# EAGLE design openebi (EAGLE 5.12)
FARNELL: 1135236

## Sheet 1 of 2
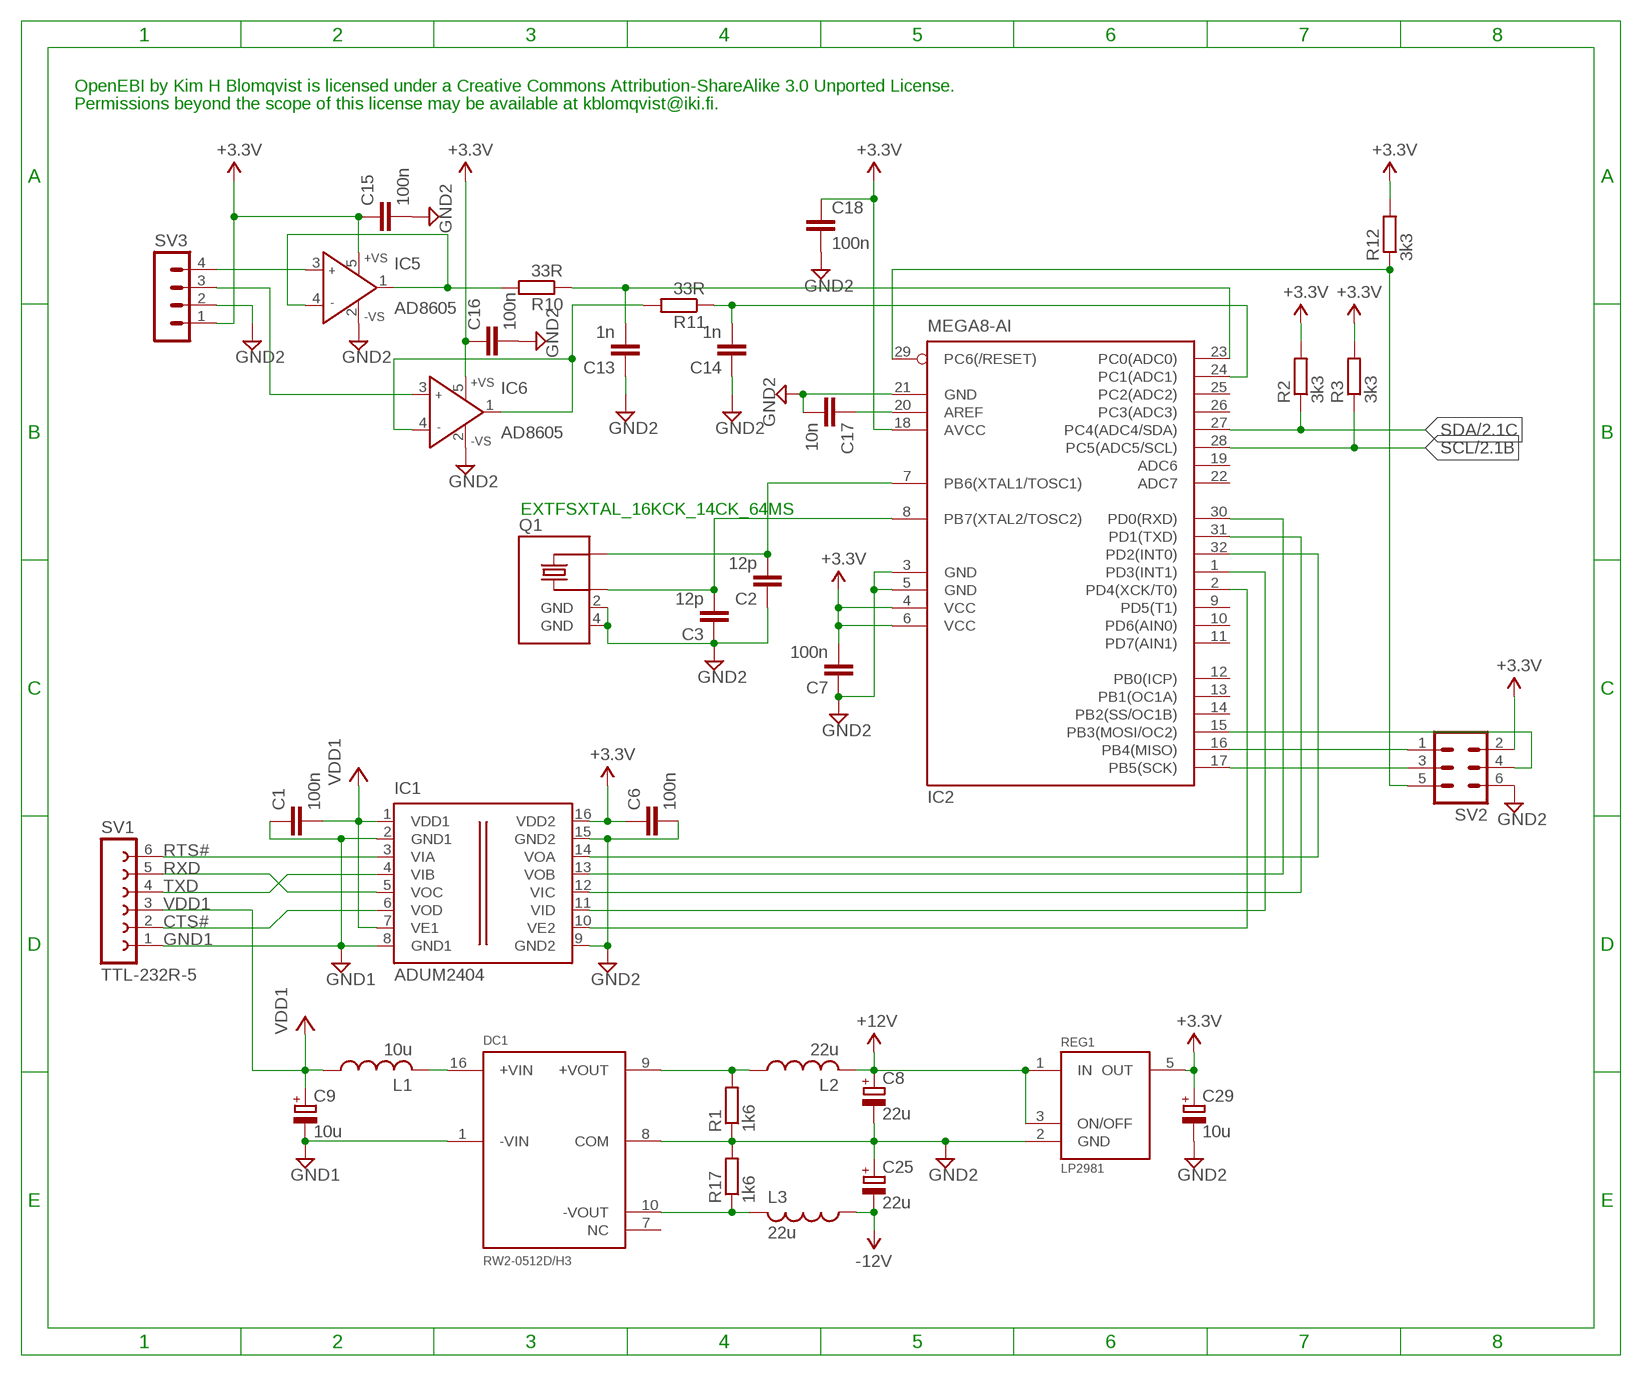
[diagram p0: schematic, sheet 1]

### Parts
C1  100n  C-EUC0402  [C0402]
C2  12p  C-EUC0402  [C0402]
C3  12p  C-EUC0402  [C0402]
C6  100n  C-EUC0402  [C0402]
C7  100n  C-EUC0402  [C0402]
C8  22u  CPOL-EUB/3528-21R  [B/3528-21R]
C9  10u  CPOL-EUA/3216-18R  [A/3216-18R]
C13  1n  C-EUC0402  [C0402]
C14  1n  C-EUC0402  [C0402]
C15  100n  C-EUC0402  [C0402]
C16  100n  C-EUC0402  [C0402]
C17  10n  C-EUC0402  [C0402]
C18  100n  C-EUC0402  [C0402]
C25  22u  CPOL-EUB/3528-21R  [B/3528-21R]
C29  10u  CPOL-EUA/3216-18R  [A/3216-18R]
DC1  RW2-0512D/H3  RECOM-RW2  [RECOM-MINI-DIP16]
IC1  ADUM2404  [SO-16W]
IC2  MEGA8-AI  [TQFP32-08]
IC5  AD8605  AD8541RJ  [SOT23-5]
IC6  AD8605  AD8541RJ  [SOT23-5]
L1  10u  L2828  [L2828]
L2  22u  L2828  [L2828]
L3  22u  L2828  [L2828]
Q1  CRYSTAL-3.2X2.5  [CRYSTAL-3.2X2.5]
R1  1k6  R-EU_R1206  [R1206]
R2  3k3  R-EU_R0402  [R0402]
R3  3k3  R-EU_R0402  [R0402]
R10  33R  R-EU_R0402  [R0402]
R11  33R  R-EU_R0402  [R0402]
R12  3k3  R-EU_R0402  [R0402]
R17  1k6  R-EU_R1206  [R1206]
REG1  LP2981  [SOT23-5]
SV1  TTL-232R-5  TTL-232R  [FE06W]
SV2  MA03-2  [MA03-2]
SV3  MA04-1  [MA04-1]

### Nets
+3.3V: C6.1 C7.2 C15.1 C16.1 C18.1 C29.+ IC1.16(VDD2) IC2.4(VCC) IC2.6(VCC) IC2.18(AVCC) IC5.5(+VS) IC6.5(+VS) R2.2 R3.2 R12.2 REG1.5(OUT) SV2.2 SV3.1
+12V: C8.+ L2.2 REG1.1(IN) REG1.3(ON/OFF) ; also sheet 2
-12V: C25.- L3.1 ; also sheet 2
CTS#: IC1.6(VOD) SV1.2(CTS#)
GND1: C1.1 C9.- DC1.1(-VIN) IC1.2(GND1) IC1.8(GND1) SV1.1(GND)
GND2: C2.1 C3.1 C6.2 C7.1 C8.- C13.1 C14.1 C15.2 C16.2 C17.2 C18.2 C25.+ C29.- DC1.8(COM) IC1.9(GND2) IC1.15(GND2) IC2.3(GND) IC2.5(GND) IC2.21(GND) IC5.2(-VS) IC6.2(-VS) Q1.2(GND) Q1.4(GND) R1.1 R17.2 REG1.2(GND) SV2.6 SV3.2 ; also sheet 2
N$1: C3.2 IC2.8(PB7(XTAL2/TOSC2)) Q1.1
N$2: C2.2 IC2.7(PB6(XTAL1/TOSC1)) Q1.3
N$3: IC1.12(VIC) IC2.31(PD1(TXD))
N$4: IC1.13(VOB) IC2.30(PD0(RXD))
N$5: IC1.14(VOA) IC2.32(PD2(INT0))
N$6: IC1.11(VID) IC2.1(PD3(INT1))
N$9: DC1.16(+VIN) L1.2
N$10: IC1.10(VE2) IC2.2(PD4(XCK/T0))
N$11: C13.2 IC2.23(PC0(ADC0)) R10.1
N$13: DC1.9(+VOUT) L2.1 R1.2
N$19: IC2.16(PB4(MISO)) SV2.1
N$20: IC2.17(PB5(SCK)) SV2.3
N$21: IC2.29(PC6(/RESET)) R12.1 SV2.5
N$22: IC2.15(PB3(MOSI/OC2)) SV2.4
N$23: C14.2 IC2.24(PC1(ADC1)) R11.1
N$25: IC5.3(IN+) SV3.4
N$26: IC6.3(IN+) SV3.3
N$27: IC5.1(OUT) IC5.4(IN-) R10.2
N$28: IC6.1(OUT) IC6.4(IN-) R11.2
N$29: C17.1 IC2.20(AREF)
N$47: DC1.10(-VOUT) L3.2 R17.1
RTS#: IC1.3(VIA) SV1.6(RTS#)
RXD: IC1.5(VOC) SV1.5(RXD)
SCL: IC2.28(PC5(ADC5/SCL)) R3.1 ; also sheet 2
SDA: IC2.27(PC4(ADC4/SDA)) R2.1 ; also sheet 2
TXD: IC1.4(VIB) SV1.4(TXD)
VDD1: C1.2 C9.+ IC1.1(VDD1) IC1.7(VE1) L1.1 SV1.3(VCC)
Unconnected: DC1.7(NC) IC2.9(PD5(T1)) IC2.10(PD6(AIN0)) IC2.11(PD7(AIN1)) IC2.12(PB0(ICP)) IC2.13(PB1(OC1A)) IC2.14(PB2(SS/OC1B)) IC2.19(ADC6) IC2.22(ADC7) IC2.25(PC2(ADC2)) IC2.26(PC3(ADC3))

### Notes on the sheet
- OpenEBI by Kim H Blomqvist is licensed under a Creative Commons Attribution-ShareAlike 3.0 Unported License.
- Permissions beyond the scope of this license may be available at kblomqvist@iki.fi.
- EXTFSXTAL_16KCK_14CK_64MS

## Sheet 2 of 2
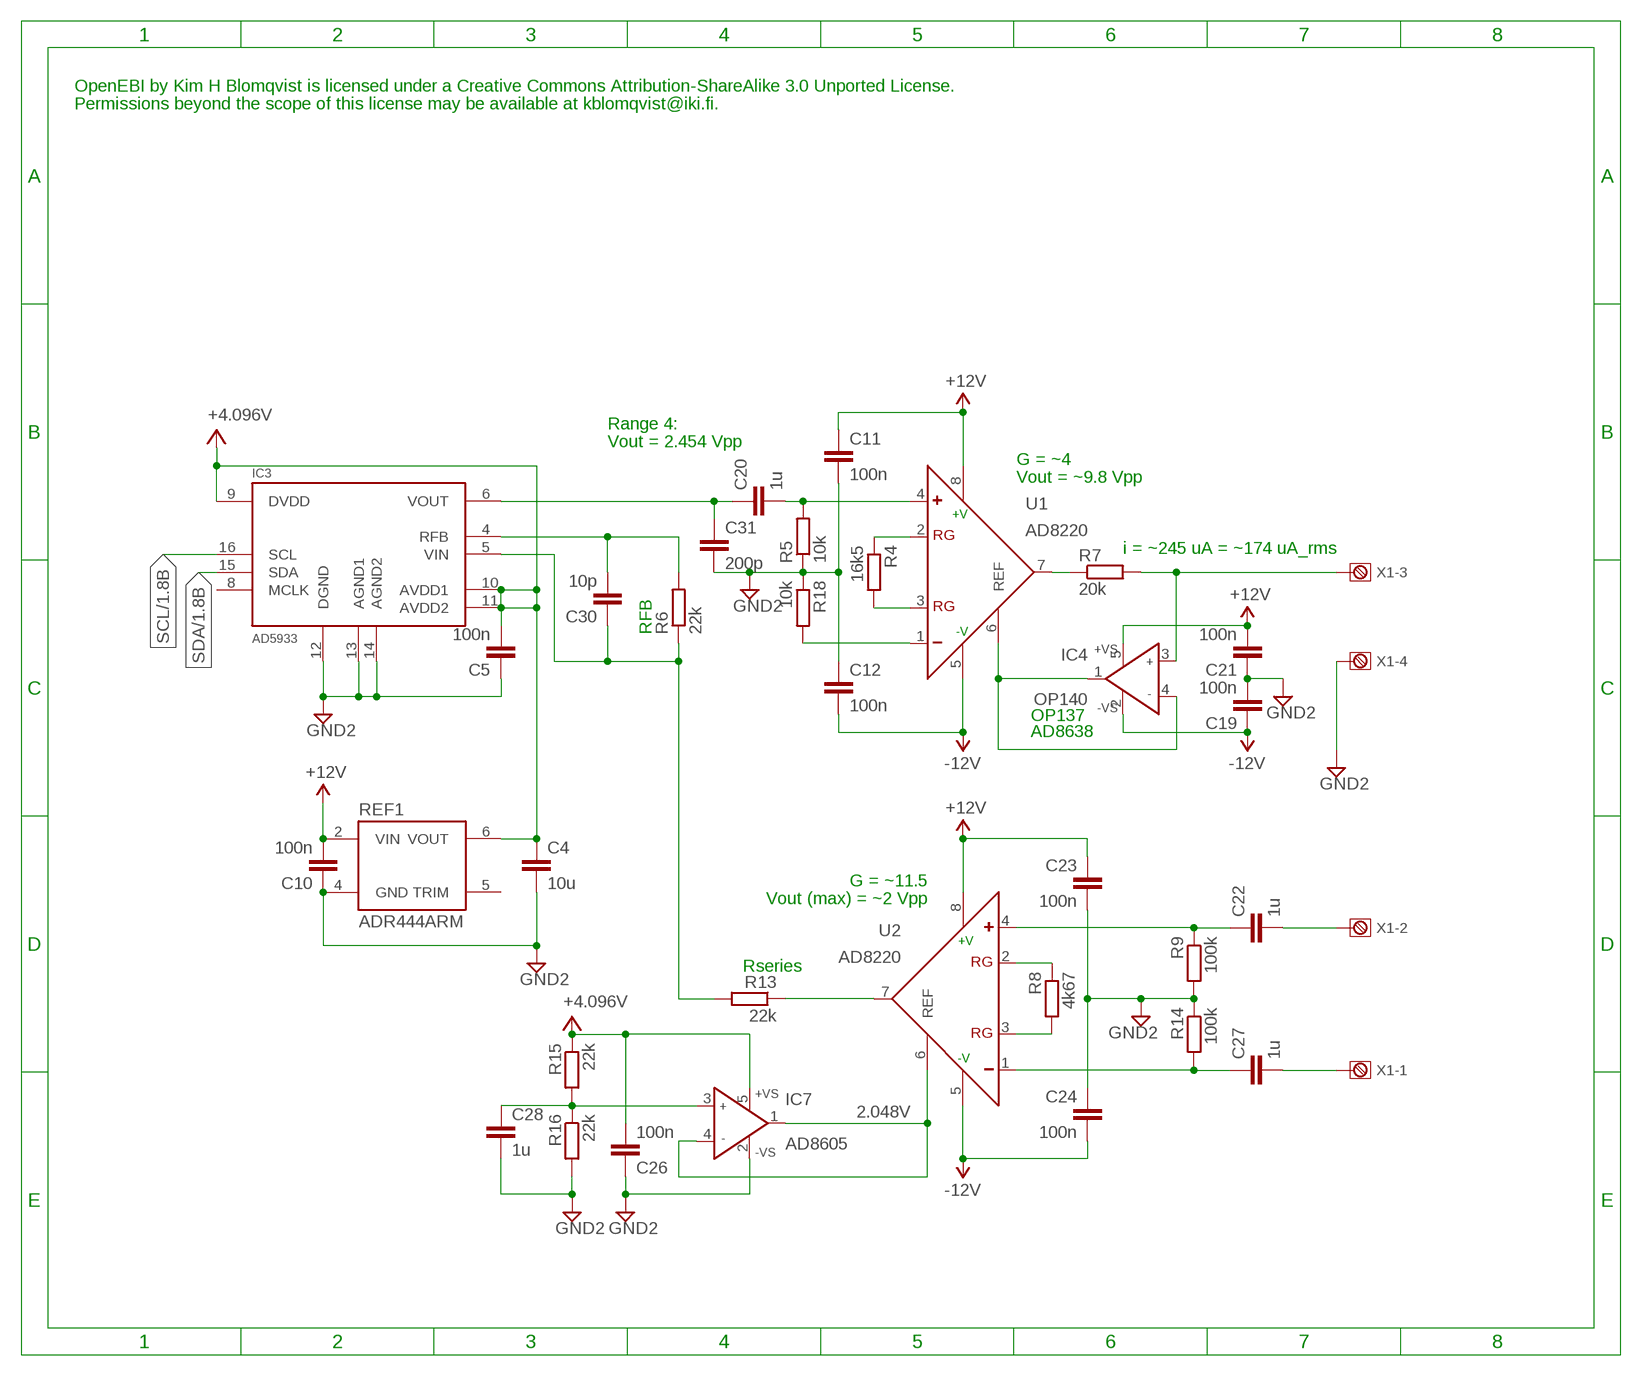
[diagram p1: schematic, sheet 2]

### Parts
C4  10u  C-EUC0805  [C0805]
C5  100n  C-EUC0402  [C0402]
C10  100n  C-EUC0402  [C0402]
C11  100n  C-EUC0402  [C0402]
C12  100n  C-EUC0402  [C0402]
C19  100n  C-EUC0402  [C0402]
C20  1u  C-EUC0402  [C0402]
C21  100n  C-EUC0402  [C0402]
C22  1u  C-EUC0402  [C0402]
C23  100n  C-EUC0402  [C0402]
C24  100n  C-EUC0402  [C0402]
C26  100n  C-EUC0402  [C0402]
C27  1u  C-EUC0402  [C0402]
C28  1u  C-EUC0402  [C0402]
C30  10p  C-EUC0402  [C0402]
C31  200p  C-EUC0402  [C0402]
IC3  AD5933  [SSOP16]
IC4  OP140  AD8541RJ  [SOT23-5]
IC7  AD8605  AD8541RJ  [SOT23-5]
R4  16k5  R-EU_R0402  [R0402]
R5  10k  R-EU_R0402  [R0402]
R6  22k  R-EU_R0402  [R0402]
R7  20k  R-EU_R0402  [R0402]
R8  4k67  R-EU_R0402  [R0402]
R9  100k  R-EU_R0402  [R0402]
R13  22k  R-EU_R0402  [R0402]
R14  100k  R-EU_R0402  [R0402]
R15  22k  R-EU_R0402  [R0402]
R16  22k  R-EU_R0402  [R0402]
R18  10k  R-EU_R0402  [R0402]
REF1  ADR444ARM  [MSOP8]
U1  AD8220  [MSOP8]
U2  AD8220  [MSOP8]
X1  MPT0.5/2.54MM/4WAY  [MPT-0.5/4-2.54]

### Nets
2.048V: IC7.1(OUT) IC7.4(IN-) U2.6(REF)
+4.096V: C4.1 C5.2 C26.2 IC3.9(DVDD) IC3.10(AVDD1) IC3.11(AVDD2) IC7.5(+VS) R15.1 REF1.6(VOUT)
+12V: C10.2 C11.1 C21.2 C23.1 IC4.5(+VS) REF1.2(VIN) U1.8(+V) U2.8(+V) ; also sheet 1
-12V: C12.2 C19.1 C24.2 IC4.2(-VS) U1.5(-V) U2.5(-V) ; also sheet 1
GND2: C4.2 C5.1 C10.1 C11.2 C12.1 C19.2 C21.1 C23.2 C24.1 C26.1 C28.2 C31.2 IC3.12(DGND) IC3.13(AGND1) IC3.14(AGND2) IC7.2(-VS) R5.1 R9.2 R14.1 R16.2 R18.1 REF1.4(GND) X1.4 ; also sheet 1
N$7: C22.2 X1.2
N$8: R4.1 U1.2(RG)
N$12: C30.2 IC3.4(RFB) R6.2
N$14: C20.1 C31.1 IC3.6(VOUT)
N$15: C20.2 R5.2 U1.4(+)
N$16: R4.2 U1.3(RG)
N$17: R7.1 U1.7(OUT)
N$18: IC4.3(IN+) R7.2 X1.3
N$24: IC4.1(OUT) IC4.4(IN-) U1.6(REF)
N$30: C27.2 X1.1
N$31: R18.2 U1.1(-)
N$33: C28.1 IC7.3(IN+) R15.2 R16.1
N$36: C22.1 R9.1 U2.4(+)
N$37: C27.1 R14.2 U2.1(-)
N$38: R8.1 U2.2(RG)
N$39: R8.2 U2.3(RG)
N$40: R13.1 U2.7(OUT)
SCL: IC3.16(SCL) ; also sheet 1
SDA: IC3.15(SDA) ; also sheet 1
VIN: C30.1 IC3.5(VIN) R6.1 R13.2
Unconnected: IC3.8(MCLK) REF1.5(TRIM)

### Notes on the sheet
- OpenEBI by Kim H Blomqvist is licensed under a Creative Commons Attribution-ShareAlike 3.0 Unported License.
- Permissions beyond the scope of this license may be available at kblomqvist@iki.fi.
- Range 4:
- Vout = 2.454 Vpp
- G = ~4
- Vout = ~9.8 Vpp
- i = ~245 uA = ~174 uA_rms
- RFB
- OP137
- AD8638
- G = ~11.5
- Vout (max) = ~2 Vpp
- Rseries

## Library data of the parts
C1-C7 C10-C24 C26 C27 C30 C31 = resistor:C-EU: CAPACITOR, European symbol
C8 C9 C25 C29 = rcl:CPOL-EU: POLARIZED CAPACITOR, European symbol
C28 = rcl:C-EU: CAPACITOR, European symbol
DC1 = openebi:RECOM-RW2
IC1 = openebi:ADUM2404: Triple-Channel Digital Isolators Source: http://www.analog.com/static/imported-files/data_sheets/ADuM1300_1301.pdf; MPN: ADUM1301BRWZ; OC_FARNELL: 1465623; OC_NEWARK: 19M0757
IC2 = atmel:MEGA8: MICROCONTROLLER 8 Kbytes FLASH, 1 kbytes SRAM, 512 bytes EEPROM, USART, 6-channel 10 bit ADC, 2-channel 8 bit ADC Pin compatible with Atmega48, ATMega88, ATMega168 Source: avr.lbr; MPN: ATMEGA8-16AU; OC_FARNELL: 9171371; OC_NEWARK: 73M8863
IC3 = openebi:AD5933: 1 MSPS, 12-Bit Impedance Converter, Network Analyzer Applications: Electrochemical analysis Bioelectrical impedance analysis Impedance spectroscopy Complex impedance measurement Corrosion monitoring and protection equipment Biomedical and automotive sensors Proximity sensing Nondestructive testing Material property analysis Fuel/battery cell condition monitoring source <http://www.analog.com/static/imported-files/data_sheets/AD5933.pdf>
IC4-IC7 = analog-devices:AD8541: General-Purpose CMOS Rail-to-Rail Amplifiers Source: http://www.analog.com/static/imported-files/data_sheets/AD8541_8542_8544.pdf; MF: ALTERA CORPORATION; MPN: AD8541ARTZ-REEL7; OC_FARNELL: 1464963; OC_NEWARK: 88H0268
L1-L3 = openebi:L2828
Q1 = openebi:CRYSTAL: Crystal
R1-R18 = resistor:R-EU_: RESISTOR, European symbol
REF1 = openebi:ADR44: Ultralow Noise, LDO XFET Voltage References with Current Sink and Source Applications: Precision data acquisition systems High resolution data converters Battery-powered instrumentation Portable medical instruments Industrial process control systems Precision instruments Optical control circuits source <http://www.analog.com/static/imported-files/data_sheets/ADR440_441_443_444_445.pdf> vref
REG1 = openebi:LP2981
SV1 = openebi:TTL-232R: FEMALE HEADER; OC_FARNELL: unknown; OC_NEWARK: unknown
SV2 = con-lstb:MA03-2: PIN HEADER; OC_FARNELL: unknown; OC_NEWARK: unknown
SV3 = con-lstb:MA04-1: PIN HEADER; OC_FARNELL: unknown; OC_NEWARK: unknown
U1 U2 = openebi:AD8220
X1 = openebi:MPT0.5/2.54MM/4WAY

## Board
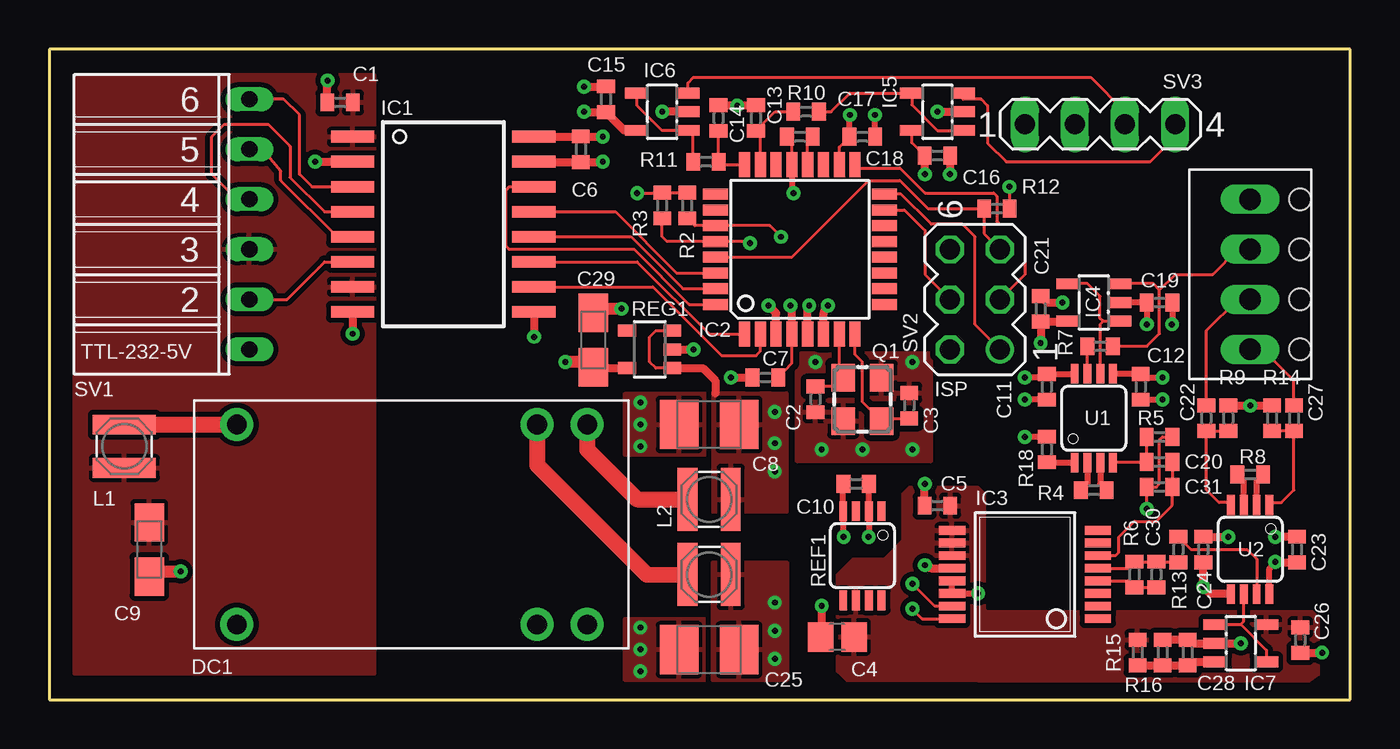
[diagram p2: board, top side]
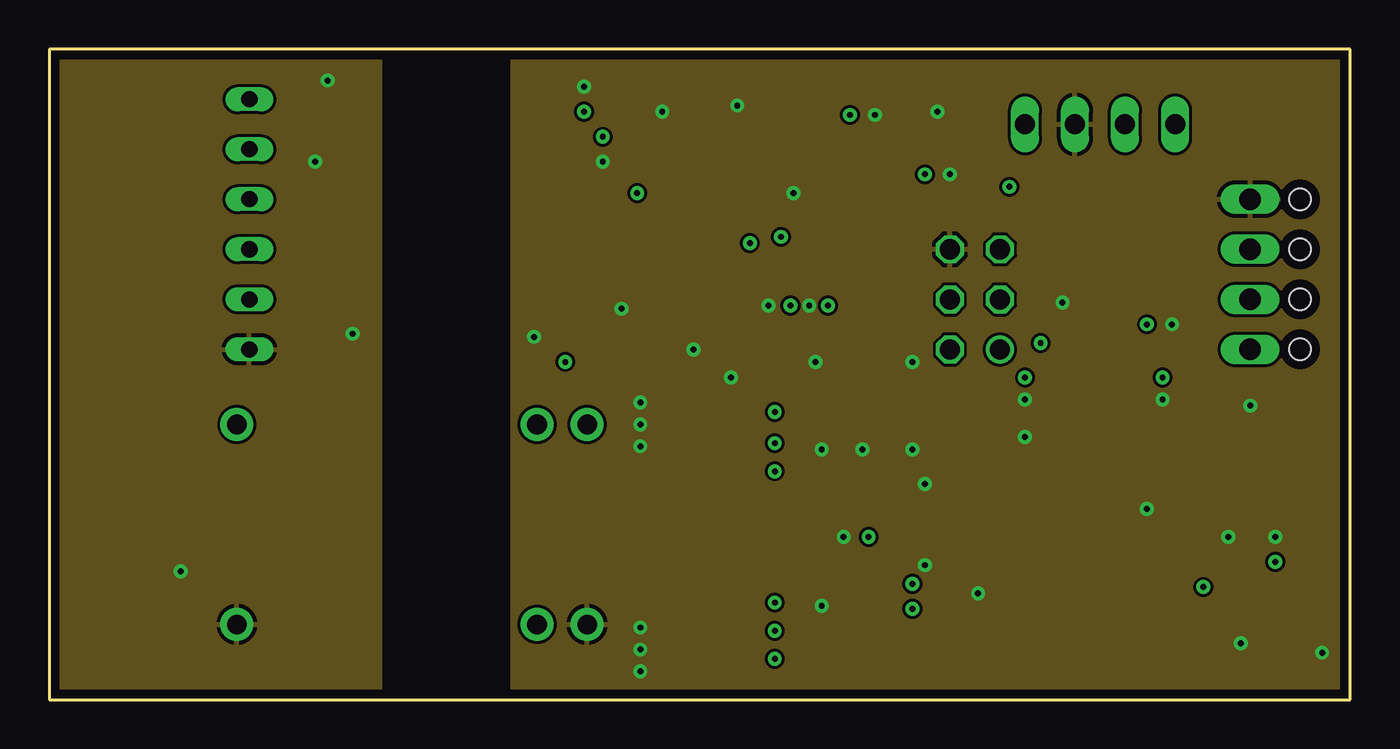
[diagram p3: board, inner layer Route2]
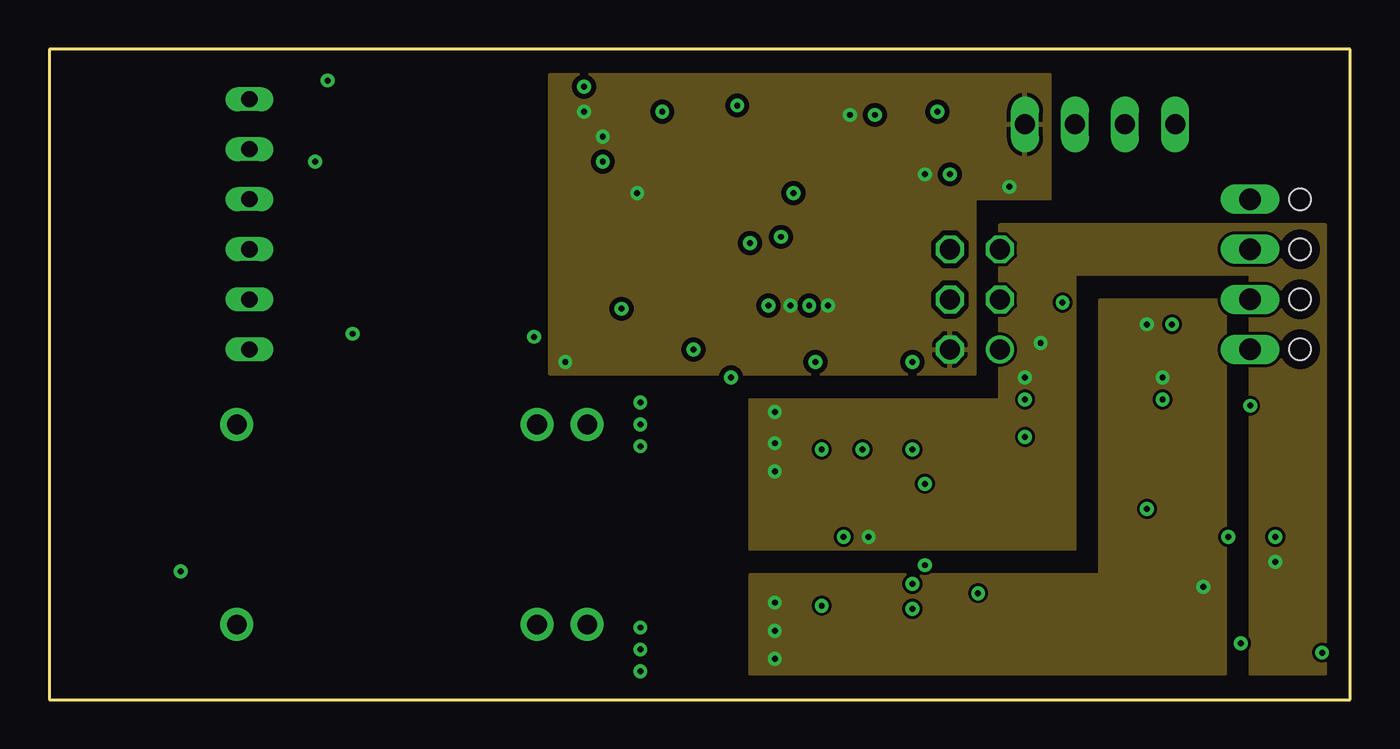
[diagram p4: board, inner layer Route15]
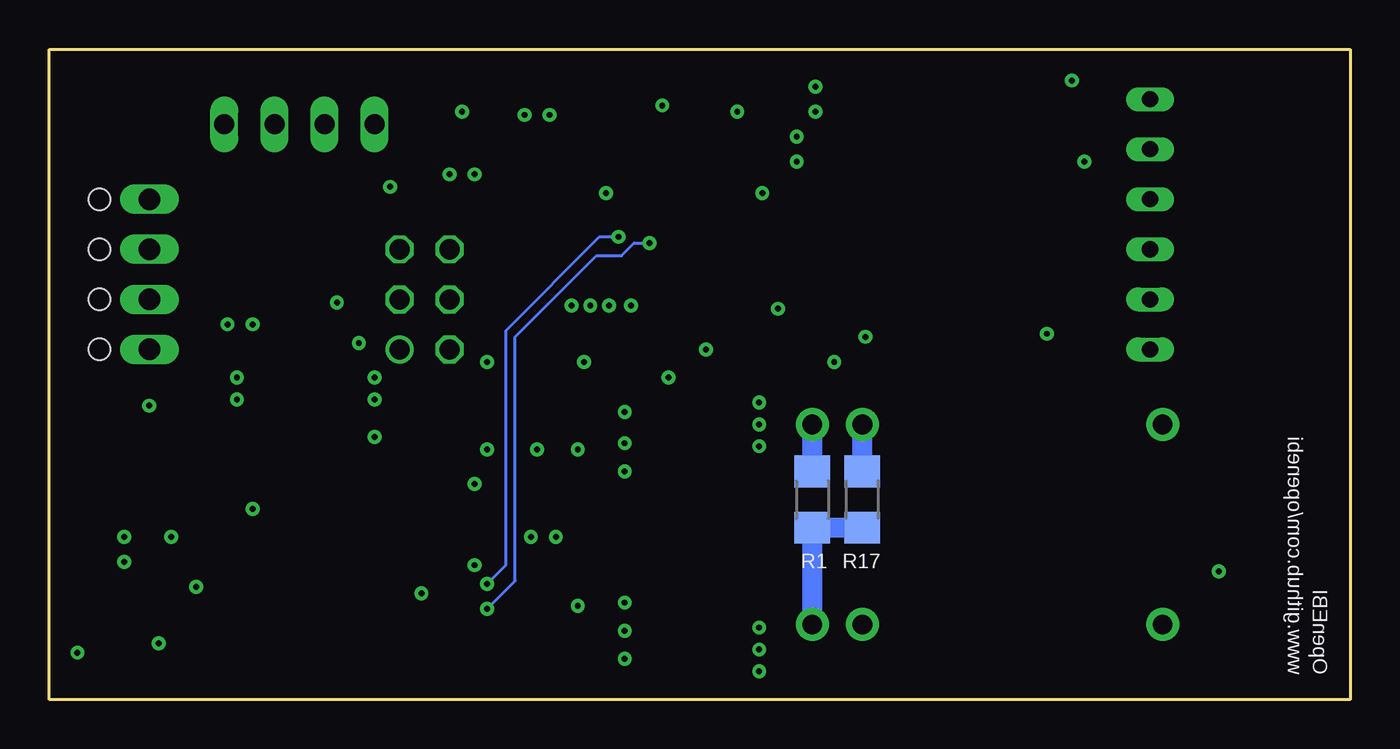
[diagram p5: board, bottom side, seen from below]

Size 66.04 x 33.02 mm. Coordinates in mm from the lower left corner, seen from the top.
Outline: 0,0 66.04,0 66.04,33.02 0,33.02 0,0
Copper layers (1*2*3*16): Top 0.018mm / dielectric 0.36mm / Route2 0.035mm / dielectric 0.71mm / Route3 0.035mm / dielectric 0.36mm / Bottom 0.018mm
Design rules "eC-PCB_proto-4-layer": minimum track width 0.15mm, minimum drill 0.25mm, track to track 0.15mm, track to pad 0.15mm, pad to pad 0.15mm, via to via 0.15mm, smd to smd 0.15mm, copper to edge 0.45mm, drill to drill 0.3mm, minimum pad ring 0.2mm, minimum via ring 0.2mm, stop-mask expansion 0.1mm, vias tented up to drill 0mil, thermal gap 0.2mm

### Footprints (pad centres in the part's own frame; a part is rotated, then mirrored left to right if it is on the bottom)
C0402 = smd 0.7 x 0.9: 1 -0.65,0; 2 0.65,0
C0805 = smd 1.3 x 1.5: 1 -0.85,0; 2 0.85,0
B/3528-21R = smd 1.95 x 2.5: + 1.525,0; - -1.525,0
A/3216-18R = smd 1.95 x 1.5: + 1.375,0; - -1.375,0
RECOM-MINI-DIP16 = drill 1 pad 1.676 round: 1 -8.89,-5.08; 7 6.35,-5.08; 8 8.89,-5.08; 9 8.89,5.08; 10 6.35,5.08; 16 -8.89,5.08
SO-16W = smd 0.6 x 2.2: 1 -4.445,-4.6; 2 -3.175,-4.6; 3 -1.905,-4.6; 4 -0.635,-4.6; 5 0.635,-4.6; 6 1.905,-4.6; 7 3.175,-4.6; 8 4.445,-4.6; 9 4.445,4.6; 10 3.175,4.6; 11 1.905,4.6; 12 0.635,4.6; 13 -0.635,4.6; 14 -1.905,4.6; 15 -3.175,4.6; 16 -4.445,4.6
TQFP32-08 = smd 1.27 x 0.559: 1 -4.293,2.8; 2 -4.293,2; 3 -4.293,1.2; 4 -4.293,0.4; 5 -4.293,-0.4; 6 -4.293,-1.2; 7 -4.293,-2; 8 -4.293,-2.8; 17 4.293,-2.8; 18 4.293,-2; 19 4.293,-1.2; 20 4.293,-0.4; 21 4.293,0.4; 22 4.293,1.2; 23 4.293,2; 24 4.293,2.8 | smd 0.559 x 1.27: 9 -2.8,-4.293; 10 -2,-4.293; 11 -1.2,-4.293; 12 -0.4,-4.293; 13 0.4,-4.293; 14 1.2,-4.293; 15 2,-4.293; 16 2.8,-4.293; 25 2.8,4.293; 26 2,4.293; 27 1.2,4.293; 28 0.4,4.293; 29 -0.4,4.293; 30 -1.2,4.293; 31 -2,4.293; 32 -2.8,4.293
SSOP16 = smd 0.44 x 1.34: 1 -2.24,-3.7; 2 -1.6,-3.7; 3 -0.96,-3.7; 4 -0.32,-3.7; 5 0.32,-3.7; 6 0.96,-3.7; 7 1.6,-3.7; 8 2.24,-3.7; 9 2.24,3.7; 10 1.6,3.7; 11 0.96,3.7; 12 0.32,3.7; 13 -0.32,3.7; 14 -0.96,3.7; 15 -1.6,3.7; 16 -2.24,3.7
SOT23-5 = smd 0.55 x 1.2: 1 -0.95,-1.3; 2 0,-1.3; 3 0.95,-1.3; 4 0.95,1.3; 5 -0.95,1.3
L2828 = smd 1 x 3.2: 1 -1.1,0; 2 1.1,0
CRYSTAL-3.2X2.5 = smd 1.4 x 1.2: 1 -1.1,-0.977; 2 1.1,-0.977; 3 1.1,0.973; 4 -1.1,0.973
R1206 = smd 1.6 x 1.803: 1 -1.422,0; 2 1.422,0
R0402 = smd 0.7 x 0.9: 1 -0.65,0; 2 0.65,0
MSOP8 = smd 0.4 x 1: 1 -0.976,-2.263; 2 -0.326,-2.263; 3 0.324,-2.263; 4 0.974,-2.263; 5 0.974,2.262; 6 0.324,2.262; 7 -0.326,2.262; 8 -0.976,2.262
SOT23-5' = smd 0.6 x 0.9: 1 -0.95,-1.15; 2 0,-1.15; 3 0.95,-1.15; 4 0.95,1.15; 5 -0.95,1.15
FE06W = drill 0.813 long: 1 -6.35,0; 2 -3.81,0; 3 -1.27,0; 4 1.27,0; 5 3.81,0; 6 6.35,0
MA03-2 = drill 1.016 round: 1 -2.54,-1.27 | drill 1.016 octagon: 2 -2.54,1.27; 3 0,-1.27; 4 0,1.27; 5 2.54,-1.27; 6 2.54,1.27
MA04-1 = drill 1.016 long: 1 -3.81,0; 2 -1.27,0; 3 1.27,0; 4 3.81,0
MPT-0.5/4-2.54 = drill 1.1 long: 1 -3.81,0; 2 -1.27,0; 3 1.27,0; 4 3.81,0 | hole 1.1: 3.81,-2.54; -1.27,-2.54; 1.27,-2.54; -3.81,-2.54

### Placement (x,y rotation side)
C1  14.76,30.32 0 top
C2  38.89,15.24 90 top
C3  43.66,14.92 270 top
C4  40.01,3.18 180 top
C5  45.09,9.84 0 top
C6  26.99,27.94 270 top
C7  36.35,16.35 0 top
C8  33.5,13.97 0 top
C9  5.08,7.62 90 top
C10  40.96,10.95 0 top
C11  50.64,15.88 270 top
C12  55.4,15.88 90 top
C13  35.88,29.53 270 top
C14  33.97,29.53 270 top
C15  28.26,30.48 90 top
C16  45.09,27.62 0 top
C17  38.1,28.57 180 top
C18  41.27,28.57 0 top
C19  56.36,20.16 0 top
C20  56.36,12.06 180 top
C21  50.32,19.84 270 top
C22  58.74,14.29 90 top
C23  63.34,7.62 90 top
C24  58.58,7.62 270 top
C25  33.5,2.54 180 top
C26  63.5,3.02 90 top
C27  63.18,14.29 90 top
C28  57.79,2.38 90 top
C29  27.62,18.26 270 top
C30  56.2,6.35 270 top
C31  56.36,10.8 180 top
DC1  18.41,8.89 0 top
IC1  20,24.13 270 top
IC2  38.1,22.86 90 top
IC3  49.53,6.35 90 top
IC4  53.02,20.16 90 top
IC5  45.09,29.84 90 top
IC6  31.11,29.84 90 top
IC7  60.48,2.86 270 top
L1  3.81,12.86 90 top
L2  33.5,10.16 0 top
L3  33.5,6.35 180 top
Q1  41.27,15.24 90 top
R1  27.3,10.16 90 bottom
R2  32.38,25.08 90 top
R3  31.11,25.08 90 top
R4  53.02,10.64 0 top
R5  56.36,13.34 180 top
R6  55.09,6.35 270 top
R7  53.34,17.94 0 top
R8  60.96,11.43 180 top
R9  59.85,14.29 90 top
R10  38.42,29.84 0 top
R11  33.34,27.3 180 top
R12  48.1,24.92 0 top
R13  57.31,7.62 270 top
R14  62.07,14.29 270 top
R15  55.24,2.38 270 top
R16  56.52,2.38 90 top
R17  24.77,10.16 270 bottom
R18  50.64,12.7 270 top
REF1  41.27,7.3 180 top
REG1  LP2981  [SOT23-5']  30.48,17.78 90 top
SV1  10.16,24.13 90 top
SV2  46.99,20.32 90 top
SV3  53.34,29.21 0 top
U1  53.02,14.29 0 top
U2  60.96,7.62 180 top
X1  60.96,21.59 90 top

### Tracks (layer width: path | path; a pad name or v marks a point on that pad's centre or on a via)
2.048V
  Top 0.15: IC7.1 60.48,3.81 | 60.48,3.81 61.78,2.51 IC7.4 | U2.6 60.64,3.96 60.48,3.81
+3.3V  (via drill 0.3)
  Top 0.15: IC2.4 37.7,17.08 C7.2 | C18.1 40.1,28.05 IC2.18 | 40.62,29.51 v40.64,29.69 | C16.1 43.78,28.27 IC5.5 | 44.44,26.68 v44.45,26.67 | R12.2 48.75,26.02 v48.74,26.04 | v29.84,25.72 31.1,25.72 R3.2 R2.2
  Top 0.305: C18.1 40.62,29.51
  Top 0.406: C16.1 44.44,26.68 | 27.68,17.14 C29.+ 27.99,16.83 REG1.5 | IC1.16 24.62,28.59 C6.1 27.93,28.59 v28.1,28.57 | v27.15,29.84 27.16,29.83 C15.1 29.19,28.89 IC6.5 | IC2.4 37.7,19.93 v37.62,20 | IC2.6 39.3,19.61 v39.53,20
  Top 0.61: 27.68,17.14 v26.19,17.14
  pour Route15 (isolate 0.254): 50.8,31.75 50.8,25.4 46.99,25.4 46.99,16.51 25.4,16.51 25.4,31.75
+4.096V
  Top 0.305: IC3.11
  pour Top (isolate 0.254): 40.01,6.35 40.8,7.14 42.39,7.14 43.34,8.1 43.34,10.48 43.66,10.79 47.15,10.79 47.47,10.48 47.47,0.95 40.48,0.95 40.01,1.43
  pour Top (isolate 0.254): 63.98,0.95 64.45,1.27 64.45,4.13 64.14,4.45 47.63,4.45 47.47,4.6 47.47,2.22 47.15,1.91 47.15,0.95
+12V  (via drill 0.3)
  Top 0.15: REG1.3 30.8,18.73 30.48,18.41 30.48,17.14 30.8,16.83 REG1.1
  Top 0.305: v62.23,6.99 61.94,6.64 U2.8 | C10.2 REF1.2 v41.6,8.26 v41.59,8.26 | U1.8 52.02,16.52 C11.1 50.47,16.35 v49.53,16.35 49.55,16.37
  Top 0.406: C23.1 62.4,6.97 v62.23,6.99 | IC4.5 51.58,19.19 C21.2 v50.32,18.1 | REG1.1 33.18,16.83 33.81,16.19 33.81,15.56
  other vias: 36.83,14.61 36.83,13.02 36.83,11.59
  pour Route15: 35.56,15.24 48.26,15.24 48.26,24.13 52.07,24.13 52.07,7.62 35.56,7.62
  pour Route15: 52.07,24.13 64.77,24.13 64.77,1.27 60.96,1.27 60.96,21.59 52.07,21.59
  pour Top (isolate 0.254): 37.46,9.53 37.46,15.56 33.66,15.56 33.66,9.53
-12V  (via drill 0.3)
  Top 0.305: IC4.2 54.34,20.18 54.35,20.16 C19.1 55.71,19.07 v55.72,19.05 | v56.52,16.35 55.58,16.35 C12.2 55.38,16.55 U1.5
  Top 0.406: v58.58,5.71 C24.2 | v58.58,5.71 | v58.58,5.71 58.94,5.36 U2.5
  other vias: 36.83,4.92 36.83,3.49 36.83,2.06
  pour Route15: 35.56,6.35 53.34,6.35 53.34,20.32 59.69,20.32 59.69,1.27 35.56,1.27
  pour Top (isolate 0.254): 33.66,6.99 37.47,6.99 37.47,0.95 33.66,0.95
CTS#
  Top 0.15: IC1.6 13.97,22.23 12.06,20.32 SV1.2
GND1  (via drill 0.3)
  Top 0.406: IC1.8 v15.4,18.57 | v13.49,27.3 IC1.2 | C1.1 14.11,31.13 v14.13,31.43
  Top 0.61: C9.- 5.34,6.51 v6.67,6.51
  pour Route2: -1.27,34.29 16.83,34.29 16.83,-1.27 -1.27,-1.27
GND2  (via drill 0.3)
  Top 0.15: 34.92,30.18 v34.92,30.16 | C17.2 37.7,28.32 IC2.21 | 41.92,29.51 v41.91,29.69 | R5.1 | R5.1 56.52,13.34 56.36,13.18 56.36,10.95 56.2,10.79 C31.2 55.72,10.78 v55.72,9.68
  Top 0.305: C18.2 41.92,29.51 | v47.15,5.4 46.98,5.39 IC3.14 IC3.13 | v37.78,25.72 37.7,25.8 IC2.21 | v40.32,8.26 40.3,8.28 REF1.4 C10.1 | v24.6,18.42 v24.61,18.41 | v56.99,19.05 57.01,19.22 C19.2 | C11.2 49.55,15.22 v49.53,15.24 | R18.1 50.63,13.34 v49.53,13.34 | C12.1 55.42,15.24 v56.52,15.24
  Top 0.406: IC6.2 v31.11,29.84 | C13.1 34.92,30.18 C14.1 | v45.09,29.84 IC5.2 | C16.2 v45.72,26.67 | IC2.3 36.9,19.61 v36.51,20 | v60.48,2.86 IC7.2 57.96,2.86 C28.2 R16.2 | R9.2 60.95,14.94 v60.96,14.92 60.98,14.94 R14.1 | C23.2 62.4,8.27 v62.23,8.26 | C24.1 59.67,8.27 v59.85,8.26 | C26.1 | C26.1 v64.61,2.38 | C5.1 44.44,10.94 v44.45,10.95 | IC3.12 44.77,6.67 v44.45,6.83 | IC1.9 v24.6,18.42 | IC1.15 24.62,27.29 C6.2 28.08,27.29 v28.1,27.3 | C15.2 27.16,31.13 v27.15,31.11 | REG1.2 v32.7,17.78 | v34.61,16.35 C7.1 | IC2.5 38.5,19.93 v38.58,20 | C4.2 39.21,3.23 v39.21,4.76 | C21.1 50.66,20.16 v51.44,20.16 | R16.2
  Top 0.61: C29.- 27.84,19.84 v29.05,19.84
  Bottom 1.016: R17.2 R1.1 DC1.8
  other vias: 43.81,17.14 41.27,12.7 43.81,12.7 39.21,12.7 38.89,17.14 30,15.08 30,13.97 30,12.86 30,3.65 30,2.54 30,1.43
  pour Route2: 23.5,-1.27 23.5,33.66 67.31,33.66 67.31,-1.27
  pour Top (isolate 0.305, rank 2): 37.94,17.62 44.77,17.62 44.77,12.06 37.94,12.06
  pour Top (isolate 0.254, rank 3): 29.21,15.56 33.34,15.56 33.34,12.38 29.21,12.38
  pour Top (isolate 0.254, rank 3): 29.21,4.13 33.34,4.13 33.34,0.95 29.21,0.95
N$1
  Top 0.15: IC2.8 40.9,17.52 41.27,17.14 41.27,15.12 Q1.1 42.38,14.27 C3.2
N$2
  Top 0.15: C2.2 40.3,15.89 Q1.3 40.1,16.54 IC2.7
N$3
  Top 0.15: IC2.31 32.16,20.86 29.53,23.5 IC1.12
N$4
  Top 0.15: IC2.30 31.84,21.66 28.73,24.77 IC1.13
N$5
  Top 0.15: IC2.32 32.49,20.06 29.69,22.86 23.34,22.86 23.18,23.02 23.18,25.88 23.34,26.04 IC1.14
N$6
  Top 0.15: IC2.1 33.5,18.57 29.84,22.23 IC1.11
N$7
  Top 0.15: C22.2 58.74,18.73 60.33,20.32 X1.2
N$8
  Top 0.305: U1.2 52.7,10.96 R4.1
N$9
  Top 0.813: L1.2 8.89,13.96 DC1.16
N$10
  Top 0.15: IC2.2 36.1,17.68 35.88,17.46 34.13,17.46 30.64,20.95 IC1.10
N$11
  Top 0.15: IC2.23 36.1,28.88 C13.2 36.84,29.84 R10.1
N$12
  Top 0.15: C30.2 R6.2 54.76,6.03 IC3.4
N$13
  Top 0.813: L2.1 29.83,10.17 27.3,12.69 DC1.9 | DC1.9
  Bottom 1.016: R1.2 DC1.9
N$14
  Top 0.15: IC3.6 54.14,7.31 54.29,7.46 54.29,8.26 55.09,9.05 56.2,9.05 57.01,9.86 C31.1 C20.1
N$15
  Top 0.15: C20.2 54.04,12.06 U1.4 | C20.2 R5.2 | C20.2
N$16
  Top 0.305: U1.3 53.35,10.96 R4.2
N$17
  Top 0.15: U1.7 R7.1
N$18
  Top 0.15: R7.2 55.72,17.94 56.36,18.57 56.36,20.8 | IC4.3 56.04,21.11 56.36,20.8 | X1.3 60.33,22.86 59.05,21.59 57.15,21.59 56.36,20.8
N$19
  Top 0.15: IC2.16 43.24,25.66 44.77,24.13 46.35,24.13 46.99,23.5 46.99,19.05 SV2.1
N$20
  Top 0.15: IC2.17 40.9,26.99 43.18,26.99 44.45,25.72 47.94,25.72 48.1,25.56 48.1,24.29 48.26,24.13 48.9,24.13 49.53,23.5 49.53,21.59 SV2.3
N$21
  Top 0.15: IC2.29 37.7,22.46 41.59,26.35 43.18,26.35 44.61,24.92 R12.1 47.45,23.67 SV2.5
N$22
  Top 0.15: SV2.4 44.45,21.59 44.45,23.81 43.4,24.86 IC2.15
N$23
  Top 0.15: C14.2 33.97,27.32 R11.1 34.14,27.15 IC2.24
N$24
  Top 0.15: U1.6 53.35,19.06 53.5,19.21 | 53.5,19.21 IC4.1 | IC4.4 52.71,21.11 53.34,20.48 53.34,19.37 53.5,19.21
N$25
  Top 0.15: SV3.4 57.15,28.57 55.88,27.3 48.58,27.3 47.62,28.26 47.62,30.16 47.31,30.48 46.39,30.48 IC5.3
N$26
  Top 0.15: IC6.3 32.41,31.3 32.7,31.59 52.86,31.59 54.61,29.84 SV3.3
N$27
  Top 0.15: R10.2 39.69,29.84 40.64,30.8 IC5.4 43.78,30.19 45.08,28.89 IC5.1
N$28
  Top 0.15: R11.2 32.69,28.89 IC6.1 31.11,28.89 29.84,30.16 29.84,30.77 IC6.4
N$29
  Top 0.15: C17.1 38.5,28.32 IC2.20
N$30
  Top 0.15: C27.2 63.18,16.19 61.59,17.78 X1.1
N$31
  Top 0.305: R18.2 52.02,12.05 U1.1
N$33
  Top 0.406: R15.2 R16.1 | R16.1 | R16.1 C28.1 57.96,1.91 IC7.3 | R16.1
N$36
  Top 0.15: U2.4 59.87,10 59.37,10 58.74,10.64 C22.1 R9.1
N$37
  Top 0.15: U2.1 62.05,10 62.55,10 63.18,10.64 C27.1 R14.2
N$38
  Top 0.305: U2.2 61.29,11.11 R8.1
N$39
  Top 0.305: U2.3 60.64,11.1 R8.2
N$40
  Top 0.15: U2.7 61.29,7.13 60.8,7.62 57.96,7.62 R13.1
N$47
  Top 0.813: L3.2 30.33,6.34 24.77,11.91 DC1.10
  Bottom 1.016: R17.1 DC1.10
RTS#
  Top 0.15: IC1.3 13.34,26.04 12.7,26.67 12.7,29.69 11.91,30.48 SV1.6
RXD
  Top 0.15: IC1.5 14.61,23.5 11.75,26.35 11.75,26.83 10.79,27.94 SV1.5
SCL  (via drill 0.3 pad 0.71)
  Top 0.15: v35.56,23.18 35.48,23.26 IC2.28 31.35,23.26 31.11,23.5 R3.1 | v43.81,4.6 44.31,4.11 IC3.16
  Bottom 0.15: v35.56,23.18 36.35,23.18 36.99,22.54 38.26,22.54 42.39,18.41 | v43.81,4.6 42.39,6.03 42.39,18.41 | 42.39,18.41
SDA  (via drill 0.3 pad 0.71)
  Top 0.15: v37.15,23.5 36.58,24.06 IC2.27 32.76,24.06 R2.1 | IC3.15 44.94,4.75 v43.81,5.87
  Bottom 0.15: v37.15,23.5 38.1,23.5 42.86,18.73 42.86,6.83 v43.81,5.87
TXD
  Top 0.15: IC1.4 13.97,24.77 12.22,26.51 12.22,28.1 11.11,29.21 8.89,29.21 8.26,28.57 8.26,26.67 9.53,25.4 SV1.4
VDD1
  pour Top (isolate 0.254): 16.51,31.75 16.51,1.27 1.27,1.27 1.27,31.75
VIN
  Top 0.15: R13.2 57.28,7 C30.1 R6.1 54.76,6.67 IC3.5

### Text on the board
tPlace: ISP
bPlace: OpenEBI | www.github.com/openebi
tNames: TTL-232-5V
Measures: 33.02 mm | 66.04 mm